# EAGLE schematic Main PCB Schematic (EAGLE 9.7.0)
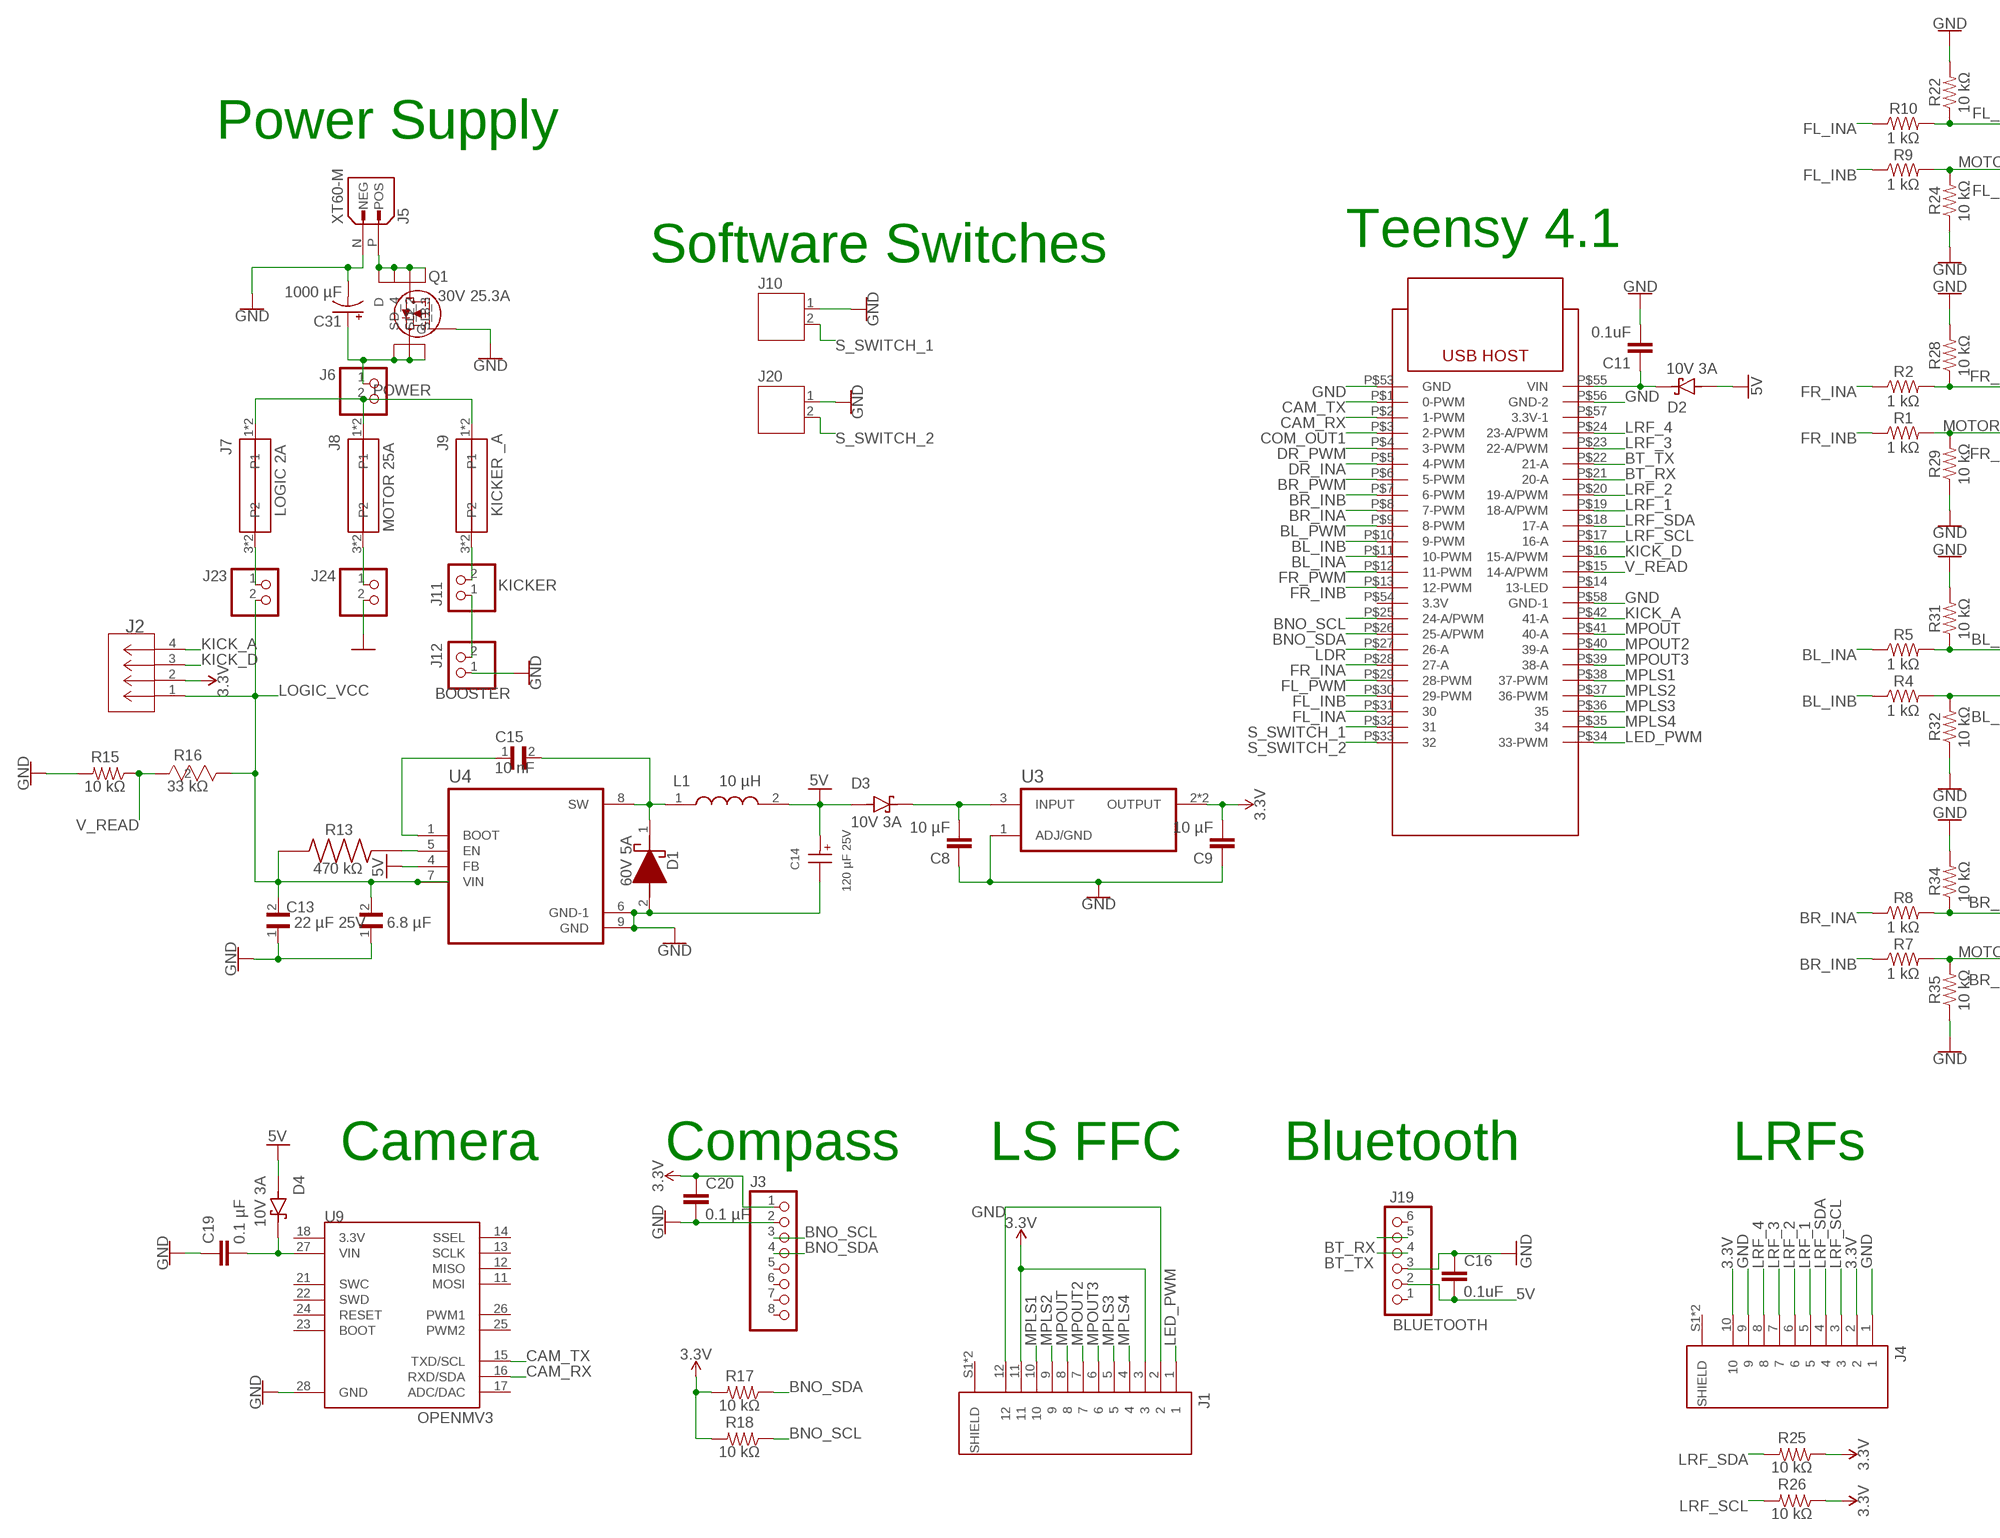
[diagram p0: schematic, sheet 1, part 1 of 2]
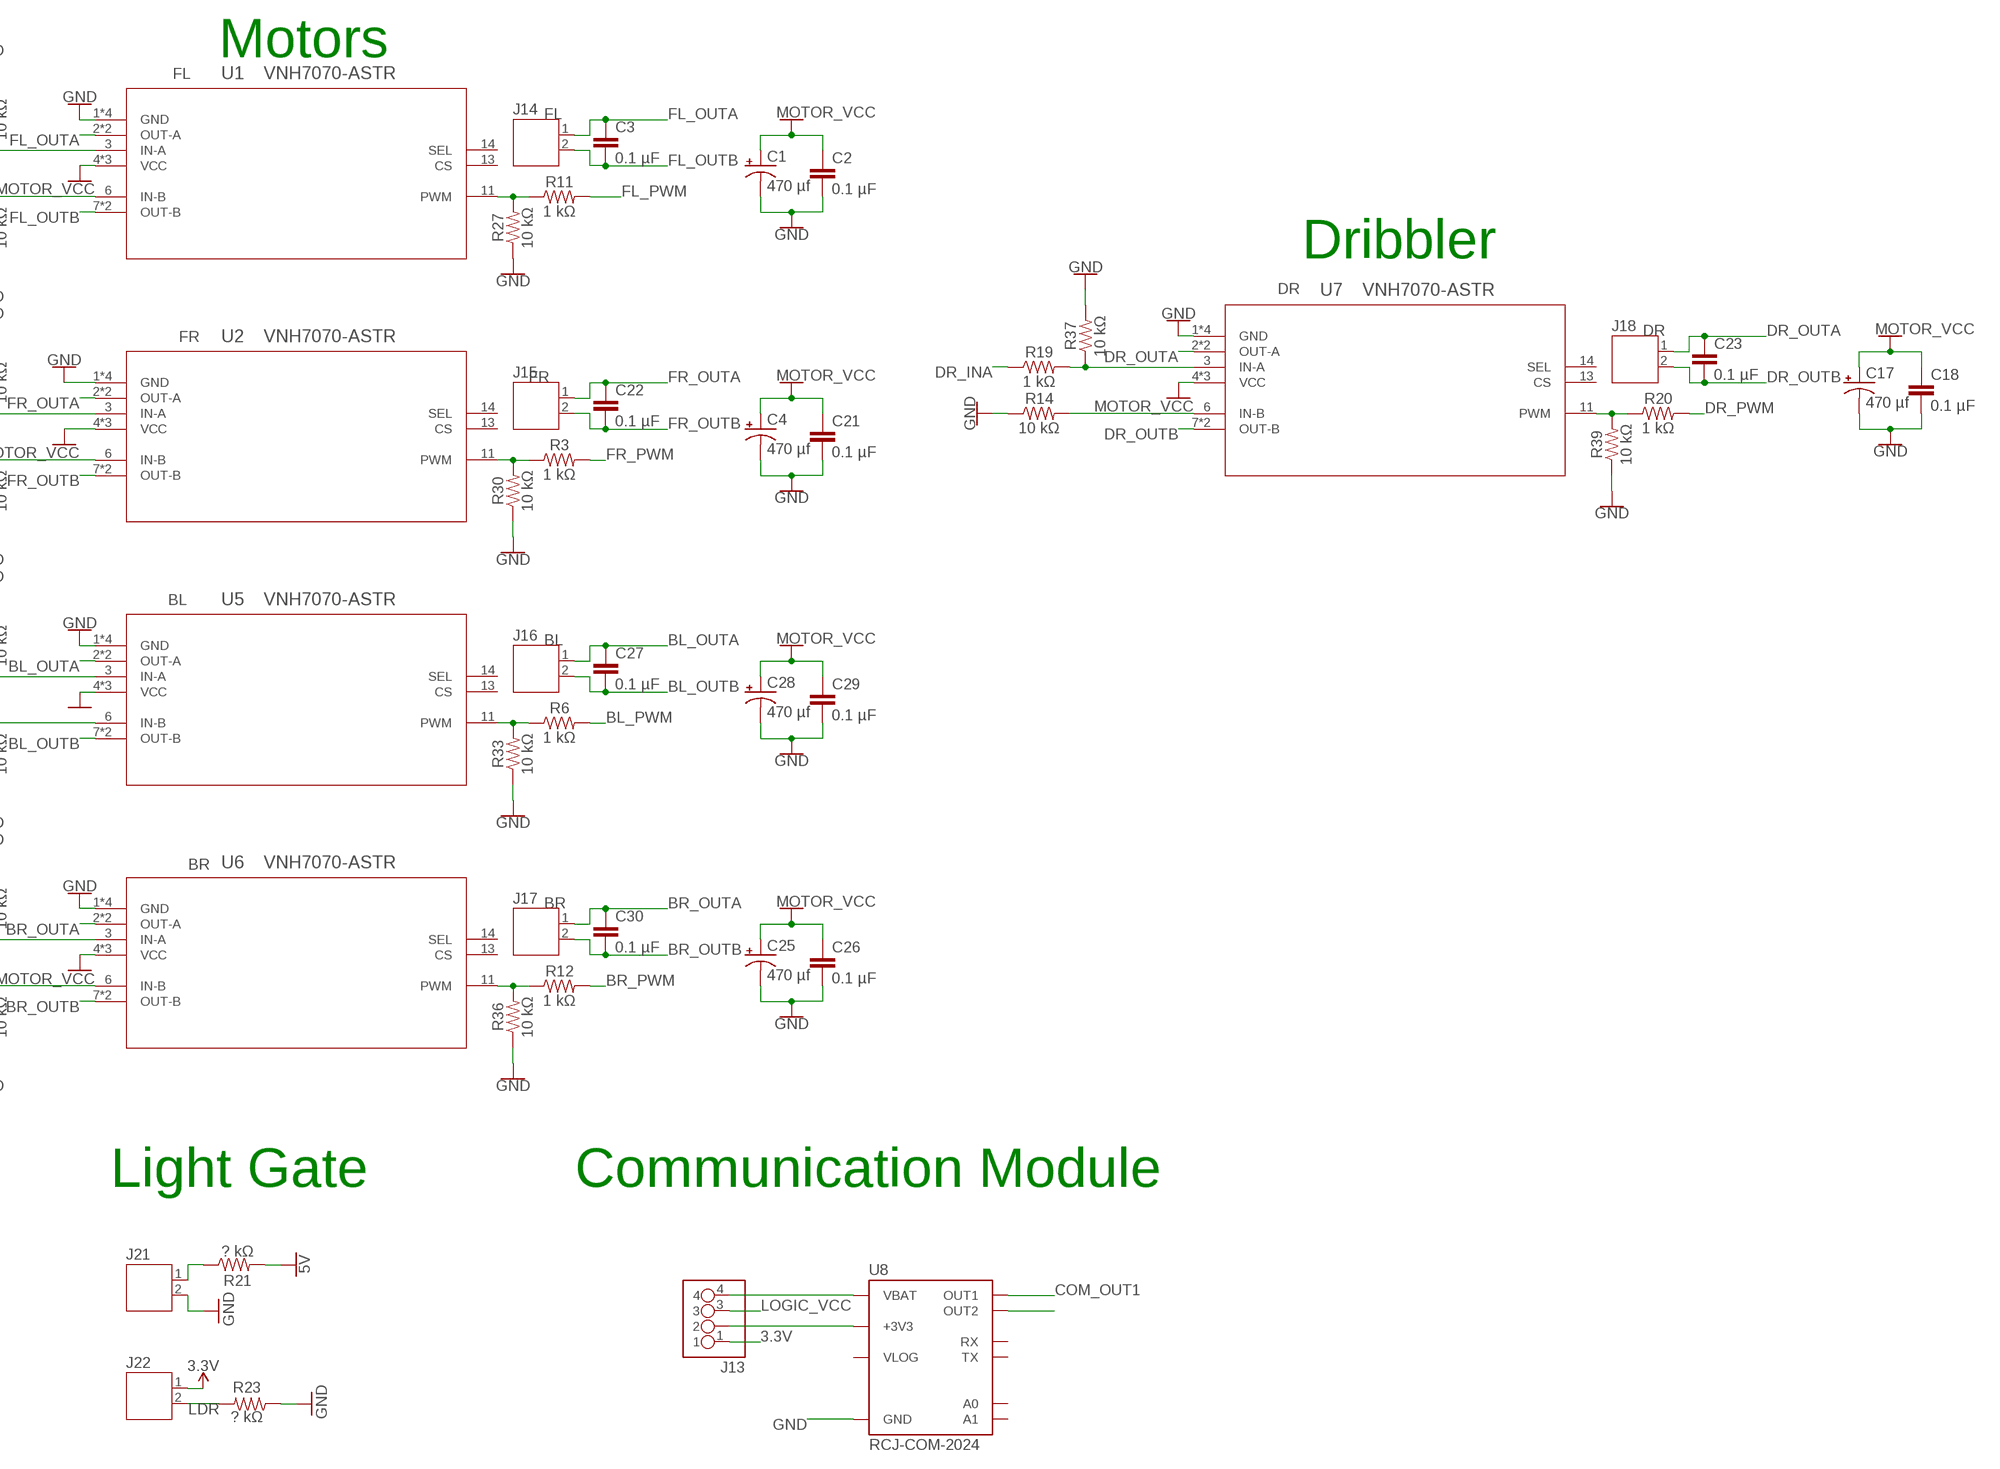
[diagram p1: schematic, sheet 1, part 2 of 2]

## Parts
C1  470 µf  1000UF-RADIAL-5MM-35V-20%-KIT  [CPOL-RADIAL-5MM-10MM-KIT]
C2  0.1 µF  0.1UF-0603-100V-10%  [0603]
C3  0.1 µF  0.1UF-0603-100V-10%  [0603]
C4  470 µf  1000UF-RADIAL-5MM-35V-20%-KIT  [CPOL-RADIAL-5MM-10MM-KIT]
C8  10 µF  0805_CAPACITOR_SMD  [SPARKFUN-CAPACITORS_0805]
C9  10 µF  0805_CAPACITOR_SMD  [SPARKFUN-CAPACITORS_0805]
C11  0.1uF  0.1UF-0603-25V-(+80/-20%)  [0603]
C12  6.8 µF  C1608X5R1E685K080AC  [CAPC1608X100N]
C13  22 µF 25V  CL21A226MAYNNNE  [CAPC2012X145N]
C14  120 µF 25V  WCAP-ATG5_6.3X11  [WCAP-ATG5_6.3X11(DXL)]
C15  10 nF  C0603C103K5RACTU  [CAPC1608X90N]
C16  0.1uF  0.1UF-0603-25V-(+80/-20%)  [0603]
C17  470 µf  1000UF-RADIAL-5MM-35V-20%-KIT  [CPOL-RADIAL-5MM-10MM-KIT]
C18  0.1 µF  0.1UF-0603-100V-10%  [0603]
C19  0.1 µF  0.1UF-0603-100V-10%  [0603]
C20  0.1 µF  0.1UF-0603-100V-10%  [0603]
C21  0.1 µF  0.1UF-0603-100V-10%  [0603]
C22  0.1 µF  0.1UF-0603-100V-10%  [0603]
C23  0.1 µF  0.1UF-0603-100V-10%  [0603]
C25  470 µf  1000UF-RADIAL-5MM-35V-20%-KIT  [CPOL-RADIAL-5MM-10MM-KIT]
C26  0.1 µF  0.1UF-0603-100V-10%  [0603]
C27  0.1 µF  0.1UF-0603-100V-10%  [0603]
C28  470 µf  1000UF-RADIAL-5MM-35V-20%-KIT  [CPOL-RADIAL-5MM-10MM-KIT]
C29  0.1 µF  0.1UF-0603-100V-10%  [0603]
C30  0.1 µF  0.1UF-0603-100V-10%  [0603]
C31  1000 µF  1000UF-RADIAL-5MM-25V-20%-NO-SILK  [CPOL-RADIAL-5MM-10MM-NS]
D1  60V 5A  SDT5A60SA-13  [SDT5A60SA13]
D2  10V 3A  PMEG1030EH,115  [DIO_PMEG1030EH,115]
D3  10V 3A  PMEG1030EH,115  [DIO_PMEG1030EH,115]
D4  10V 3A  PMEG1030EH,115  [DIO_PMEG1030EH,115]
J1  1-84953-2  [TE_1-84953-2]
J2  B4B-PH-K-SCONN4_B4B-PH_JST  [CONN4_B4B-PH_JST]
J3  PINHD-1X8  [1X08]
J4  1-84953-0  [TE_1-84953-0]
J5  XT60-M  [AMASS_XT60-M]
J6  POWER  B2P-VH  [B2P-VH]
J7  LOGIC 2A  3568-FUSEHOLDER  [3568-FUSEHOLDER]
J8  MOTOR 25A  3568-FUSEHOLDER  [3568-FUSEHOLDER]
J9  KICKER _A  3568-FUSEHOLDER  [3568-FUSEHOLDER]
J10  JST-PH2  [JST-PH2]
J11  KICKER  B2P-VH  [B2P-VH]
J12  BOOSTER  B2P-VH  [B2P-VH]
J13  PINHD-1X04_1X04M  [1X04]
J14  JST-PH2  [JST-PH2]
J15  JST-PH2  [JST-PH2]
J16  JST-PH2  [JST-PH2]
J17  JST-PH2  [JST-PH2]
J18  JST-PH2  [JST-PH2]
J19  PINHD-1X6  [1X06]
J20  JST-PH2  [JST-PH2]
J21  JST-PH2  [JST-PH2]
J22  JST-PH2  [JST-PH2]
J23  LOGIC  B2P-VH  [B2P-VH]
J24  MOTOR  B2P-VH  [B2P-VH]
L1  10 µH  PA5431.103NLT  [PA5431103NLT]
Q1  30V 25.3A  SI4143DY-T1-GE3SOIC_3DY-T1-GE3_VIS  [SOIC_3DY-T1-GE3_VIS]
R1  1 kΩ  0.1OHM-0603-1/3W-1%  [0603]
R2  1 kΩ  0.1OHM-0603-1/3W-1%  [0603]
R3  1 kΩ  0.1OHM-0603-1/3W-1%  [0603]
R4  1 kΩ  0.1OHM-0603-1/3W-1%  [0603]
R5  1 kΩ  0.1OHM-0603-1/3W-1%  [0603]
R6  1 kΩ  0.1OHM-0603-1/3W-1%  [0603]
R7  1 kΩ  0.1OHM-0603-1/3W-1%  [0603]
R8  1 kΩ  0.1OHM-0603-1/3W-1%  [0603]
R9  1 kΩ  0.1OHM-0603-1/3W-1%  [0603]
R10  1 kΩ  0.1OHM-0603-1/3W-1%  [0603]
R11  1 kΩ  0.1OHM-0603-1/3W-1%  [0603]
R12  1 kΩ  0.1OHM-0603-1/3W-1%  [0603]
R13  470 kΩ  RMCF0603FT470K  [RESC1508X55N]
R14  10 kΩ  0.1OHM-0603-1/3W-1%  [0603]
R15  10 kΩ  1KOHM-0603-1/10W-1%  [0603@1]
R16  33 kΩ  RC0603FR-0733KLRC0603N_YAG  [RC0603N_YAG]
R17  10 kΩ  1KOHM-0603-1/10W-1%  [0603@1]
R18  10 kΩ  1KOHM-0603-1/10W-1%  [0603@1]
R19  1 kΩ  0.1OHM-0603-1/3W-1%  [0603]
R20  1 kΩ  0.1OHM-0603-1/3W-1%  [0603]
R21  ? kΩ  1KOHM-0603-1/10W-1%  [0603@1]
R22  10 kΩ  0.1OHM-0603-1/3W-1%  [0603]
R23  ? kΩ  1KOHM-0603-1/10W-1%  [0603@1]
R24  10 kΩ  0.1OHM-0603-1/3W-1%  [0603]
R25  10 kΩ  1KOHM-0603-1/10W-1%  [0603@1]
R26  10 kΩ  1KOHM-0603-1/10W-1%  [0603@1]
R27  10 kΩ  0.1OHM-0603-1/3W-1%  [0603]
R28  10 kΩ  0.1OHM-0603-1/3W-1%  [0603]
R29  10 kΩ  0.1OHM-0603-1/3W-1%  [0603]
R30  10 kΩ  0.1OHM-0603-1/3W-1%  [0603]
R31  10 kΩ  0.1OHM-0603-1/3W-1%  [0603]
R32  10 kΩ  0.1OHM-0603-1/3W-1%  [0603]
R33  10 kΩ  0.1OHM-0603-1/3W-1%  [0603]
R34  10 kΩ  0.1OHM-0603-1/3W-1%  [0603]
R35  10 kΩ  0.1OHM-0603-1/3W-1%  [0603]
R36  10 kΩ  0.1OHM-0603-1/3W-1%  [0603]
R37  10 kΩ  0.1OHM-0603-1/3W-1%  [0603]
R39  10 kΩ  0.1OHM-0603-1/3W-1%  [0603]
U1  VNH7070-ASTR  [VNH7070-ASTR]
U2  VNH7070-ASTR  [VNH7070-ASTR]
U3  LM1084IS-3.3/NOPB  [TO254P1524X483-4N]
U4  LM22676MRX-5.0/NOPB  [VREG_LM5017MR/NOPB]
U5  VNH7070-ASTR  [VNH7070-ASTR]
U6  VNH7070-ASTR  [VNH7070-ASTR]
U7  VNH7070-ASTR  [VNH7070-ASTR]
U8  RCJ-COM-2024  [RCJ-COM-2024]
U9  OPENMV3  [OPENMV3]
U$4  TEENSY4.1  [TEENSY4.1]

## Nets
3.3V: C9.2 C20.1 J1.3 J1.11 J2.2 J3.1 J4.2 J4.10 J13.1 J22.1 R17.2 R18.2 R25.1 R26.1 U3.2(OUTPUT) U3.4(OUTPUT)
5V: C14.1(+) C16.2 D2.2(A) D3.2(A) D4.2(A) J19.2 L1.2 R21.2 U4.4(FB)
BL_INA: R5.1 U$4.P$11(10-PWM)
BL_INB: R4.1 U$4.P$10(9-PWM)
BL_OUTA: C27.1 J16.1 U5.2(OUT-A) U5.15(OUT-A)
BL_OUTB: C27.2 J16.2 U5.7(OUT-B) U5.10(OUT-B)
BL_PWM: R6.2 U$4.P$9(8-PWM)
BNO_SCL: J3.3 R18.1 U$4.P$25(24-A/PWM)
BNO_SDA: J3.4 R17.1 U$4.P$26(25-A/PWM)
BR_INA: R8.1 U$4.P$8(7-PWM)
BR_INB: R7.1 U$4.P$7(6-PWM)
BR_OUTA: C30.1 J17.1 U6.2(OUT-A) U6.15(OUT-A)
BR_OUTB: C30.2 J17.2 U6.7(OUT-B) U6.10(OUT-B)
BR_PWM: R12.2 U$4.P$6(5-PWM)
BT_RX: J19.5 U$4.P$21(20-A)
BT_TX: J19.4 U$4.P$22(21-A)
CAM_RX: U9.16(RXD/SDA) U$4.P$2(1-PWM)
CAM_TX: U9.15(TXD/SCL) U$4.P$1(0-PWM)
COM_OUT1: U8.OUT1 U$4.P$3(2-PWM)
DR_INA: R19.1 U$4.P$5(4-PWM)
DR_OUTA: C23.1 J18.1 U7.2(OUT-A) U7.15(OUT-A)
DR_OUTB: C23.2 J18.2 U7.7(OUT-B) U7.10(OUT-B)
DR_PWM: R20.2 U$4.P$4(3-PWM)
FL_INA: R10.1 U$4.P$31
FL_INB: R9.1 U$4.P$30(29-PWM)
FL_OUTA: C3.1 J14.1 U1.2(OUT-A) U1.15(OUT-A)
FL_OUTB: C3.2 J14.2 U1.7(OUT-B) U1.10(OUT-B)
FL_PWM: R11.2 U$4.P$29(28-PWM)
FR_INA: R2.1 U$4.P$28(27-A)
FR_INB: R1.1 U$4.P$13(12-PWM)
FR_OUTA: C22.1 J15.1 U2.2(OUT-A) U2.15(OUT-A)
FR_OUTB: C22.2 J15.2 U2.7(OUT-B) U2.10(OUT-B)
FR_PWM: R3.2 U$4.P$12(11-PWM)
GND: C1.- C2.2 C4.- C8.1 C9.1 C11.2 C12.1 C13.1 C14.2(-) C16.1 C17.- C18.2 C19.1 C20.2 C21.2 C25.- C26.2 C28.- C29.2 C31.- D1.2(A) J1.2 J1.12 J3.2 J4.1 J4.9 J5.N(NEG) J10.1 J12.1 J19.3 J20.1 J21.2 Q1.4(G) R14.1 R15.2 R22.2 R23.1 R24.1 R27.1 R28.2 R29.1 R30.1 R31.2 R32.1 R33.1 R34.2 R35.1 R36.1 R37.2 R39.1 U1.1(GND) U1.8(GND) U1.9(GND) U1.16(GND) U2.1(GND) U2.8(GND) U2.9(GND) U2.16(GND) U3.1(ADJ/GND) U4.6(GND-1) U4.9(GND) U5.1(GND) U5.8(GND) U5.9(GND) U5.16(GND) U6.1(GND) U6.8(GND) U6.9(GND) U6.16(GND) U7.1(GND) U7.8(GND) U7.9(GND) U7.16(GND) U8.GND U9.28(GND) U$4.P$53(GND) U$4.P$56(GND-2) U$4.P$58(GND-1)
KICK_A: J2.4 U$4.P$42(41-A)
KICK_D: J2.3 U$4.P$16(15-A/PWM)
LDR: J22.2 R23.2 U$4.P$27(26-A)
LED_PWM: J1.1 U$4.P$34(33-PWM)
LOGIC_VCC: C12.2 C13.2 J2.1 J13.3 J23.2 R13.1 R16.1 U4.7(VIN)
LRF_1: J4.5 U$4.P$19(18-A/PWM)
LRF_2: J4.6 U$4.P$20(19-A/PWM)
LRF_3: J4.7 U$4.P$23(22-A/PWM)
LRF_4: J4.8 U$4.P$24(23-A/PWM)
LRF_SCL: J4.3 R26.2 U$4.P$17(16-A)
LRF_SDA: J4.4 R25.2 U$4.P$18(17-A)
MOTOR_VCC: C1.+ C2.1 C4.+ C17.+ C18.1 C21.1 C25.+ C26.1 C28.+ C29.1 J24.2 U1.4(VCC) U1.5(VCC) U1.12(VCC) U2.4(VCC) U2.5(VCC) U2.12(VCC) U5.4(VCC) U5.5(VCC) U5.12(VCC) U6.4(VCC) U6.5(VCC) U6.12(VCC) U7.4(VCC) U7.5(VCC) U7.12(VCC)
MPLS1: J1.10 U$4.P$38(37-PWM)
MPLS2: J1.9 U$4.P$37(36-PWM)
MPLS3: J1.5 U$4.P$36
MPLS4: J1.4 U$4.P$35
MPOUT: J1.8 U$4.P$41(40-A)
MPOUT2: J1.7 U$4.P$40(39-A)
MPOUT3: J1.6 U$4.P$39(38-A)
N$1: R2.2 R28.1 U2.3(IN-A)
N$2: R3.1 R30.2 U2.11(PWM)
N$3: C8.2 D3.1(K) U3.3(INPUT)
N$4: J6.2 J7.1 J7.2(P1) J8.1 J8.2(P1) J9.1 J9.2(P1)
N$5: R1.2 R29.2 U2.6(IN-B)
N$6: R5.2 R31.1 U5.3(IN-A)
N$7: R6.1 R33.2 U5.11(PWM)
N$8: R4.2 R32.2 U5.6(IN-B)
N$9: R10.2 R22.1 U1.3(IN-A)
N$10: R11.1 R27.2 U1.11(PWM)
N$11: R9.2 R24.2 U1.6(IN-B)
N$12: R8.2 R34.1 U6.3(IN-A)
N$13: R12.1 R36.2 U6.11(PWM)
N$14: R7.2 R35.2 U6.6(IN-B)
N$15: C11.1 D2.1(K) U$4.P$55(VIN)
N$17: R13.2 U4.5(EN)
N$18: C15.2 D1.1(K) L1.1 U4.8(SW)
N$19: C15.1 U4.1(BOOT)
N$20: J21.1 R21.1
N$21: C19.2 D4.1(K) U9.27(VIN)
N$22: J5.P(POS) Q1.5(D_3) Q1.6(D_2) Q1.7(D_4) Q1.8(D)
N$23: C31.+ J6.1 Q1.1(S_3) Q1.2(S_2) Q1.3(S)
N$24: R19.2 R37.1 U7.3(IN-A)
N$25: R20.1 R39.2 U7.11(PWM)
N$26: R14.2 U7.6(IN-B)
N$27: J9.3(P2) J9.4(P2) J11.2
N$28: J11.1 J12.2
N$29: J13.4 U8.VBAT
N$30: U8.OUT2
N$31: J7.3(P2) J7.4(P2) J23.1
N$32: J13.2 U8.+3V3
N$33: J8.3(P2) J8.4(P2) J24.1
S_SWITCH_1: J10.2 U$4.P$32
S_SWITCH_2: J20.2 U$4.P$33
V_READ: R15.1 R16.2 U$4.P$15(14-A/PWM)
Unconnected: J1.S1(SHIELD) J1.S2(SHIELD) J3.5 J3.6 J3.7 J3.8 J4.S1(SHIELD) J4.S2(SHIELD) J19.1 J19.6 U1.13(CS) U1.14(SEL) U2.13(CS) U2.14(SEL) U5.13(CS) U5.14(SEL) U6.13(CS) U6.14(SEL) U7.13(CS) U7.14(SEL) U8.A0 U8.A1 U8.RX U8.TX U8.VLOG U9.11(MOSI) U9.12(MISO) U9.13(SCLK) U9.14(SSEL) U9.17(ADC/DAC) U9.18(3.3V) U9.21(SWC) U9.22(SWD) U9.23(BOOT) U9.24(RESET) U9.25(PWM2) U9.26(PWM1) U$4.P$14(13-LED) U$4.P$54(3.3V) U$4.P$57(3.3V-1)

## Notes on the sheet
- Motors
- FL
- FL
- Power Supply
- Teensy 4.1 | Dribbler
- Software Switches
- DR
- DR
- FR
- FR
- POWER
- BL
- BL
- BR
- BR
- Camera | Compass | LS FFC | Bluetooth | LRFs | Light Gate | Communication Module
- BLUETOOTH

## Library data of the parts
C1 C4 C17 C25 C28 C31 = SparkFun-Capacitors:1000UF: 1,000µF/1mF ceramic capacitors A capacitor is a passive two-terminal electrical component used to store electrical energy temporarily in an electric field. CAP-08070
C2 C3 C11 C16 C18-C23 C26 C27 C29 C30 = SparkFun-Capacitors:0.1UF: 0.1µF ceramic capacitors A capacitor is a passive two-terminal electrical component used to store electrical energy temporarily in an electric field.
C8 C9 = Capacitors:0805_CAPACITOR_SMD
C12 = 6:C1608X5R1E685K080AC
C13 = 22 µF 25V Capacitor:CL21A226MAYNNNE
C14 = 120 µF 25V Capacitor:WCAP-ATG5_6.3X11
C15 = 10 nF 50V Capacitor:C0603C103K5RACTU
D1 = 60V 5A Schottky Diode:SDT5A60SA-13: Diode 60 V 5A Surface Mount SMA Source: Datasheet <https://www.diodes.com/assets/Datasheets/SDT5A60SA.pdf>
D2-D4 = 10V 3A Schottky Diode:PMEG1030EH,115: Check availability <https://pricing.snapeda.com/parts/PMEG1030EH%2C115/Nexperia/view-part?ref=eda>
J1 = real 12p ffc connector:1-84953-2
J2 = 4p kicker thing:B4B-PH-K-S
J3 = pinhead:PINHD-1X8: PIN HEADER
J4 = 1-84953-0:1-84953-0
J5 = XT60-M:XT60-M
J6 J11 J12 J23 J24 = JST-VH:B2P-VH: Wire-to-Board 3.96mm pitch top mount connector Source: http://www.jst-mfg.com/product/pdf/jpn/VH.pdf http://www.jst-mfg.com/product/detail.php?series=262
J7-J9 = ROBO:3568-FUSEHOLDER
J10 J14-J18 J20-J22 = jst-ph:JST-PH2
J13 = Tinkercad:PINHD-1X04
J19 = adafruit:PINHD-1X6: PIN HEADER
L1 = 10 µH 3:PA5431.103NLT: Power Inductors - SMD IND Composite 4040 Source: Datasheet <https://productfinder.pulseelectronics.com/api/open/part-attachments/datasheet/pa5431.822nlt>
Q1 = weird 30V 25:SI4143DY-T1-GE3
R1-R12 R14 R19 R20 R22 R24 R27-R37 R39 = SparkFun-Resistors:0.1OHM: 0.1Ω resistor A resistor is a passive two-terminal electrical component that implements electrical resistance as a circuit element. Resistors act to reduce current flow, and, at the same time, act to lower voltage levels within circuits. - Wikipedia
R13 = 470 kΩ Resistor:RMCF0603FT470K
R15 R17 R18 R21 R23 R25 R26 = SparkFun-Resistors:1KOHM: 1kΩ resistor A resistor is a passive two-terminal electrical component that implements electrical resistance as a circuit element. Resistors act to reduce current flow, and, at the same time, act to lower voltage levels within circuits. - Wikipedia
R16 = 33k ohm resistor:RC0603FR-0733KL
U1 U2 U5-U7 = VNH7070-ASTR:VNH7070-ASTR
U3 = Linear 3:LM1084IS-3.3/NOPB: Check availability <https://pricing.snapeda.com/parts/LM1084IS-3.3/NOPB/Texas%20Instruments/view-part?ref=eda>
U4 = LM22676MRX-5.0_NOPB:LM22676MRX-5.0/NOPB
U8 = RCJ-COM 2024 eagle:RCJ-COM-2024: RCJ Communication Module This is a module provided by the organizers of a tournament and used to control the robots via the Smartphones of a referee. Link to Github <https://github.com/robocup-junior/soccer-communication-module>
U9 = OpenMV:OPENMV3
U$4 = Teensy 4:TEENSY4.1